# EAGLE design numeric (EAGLE 7.7.0)
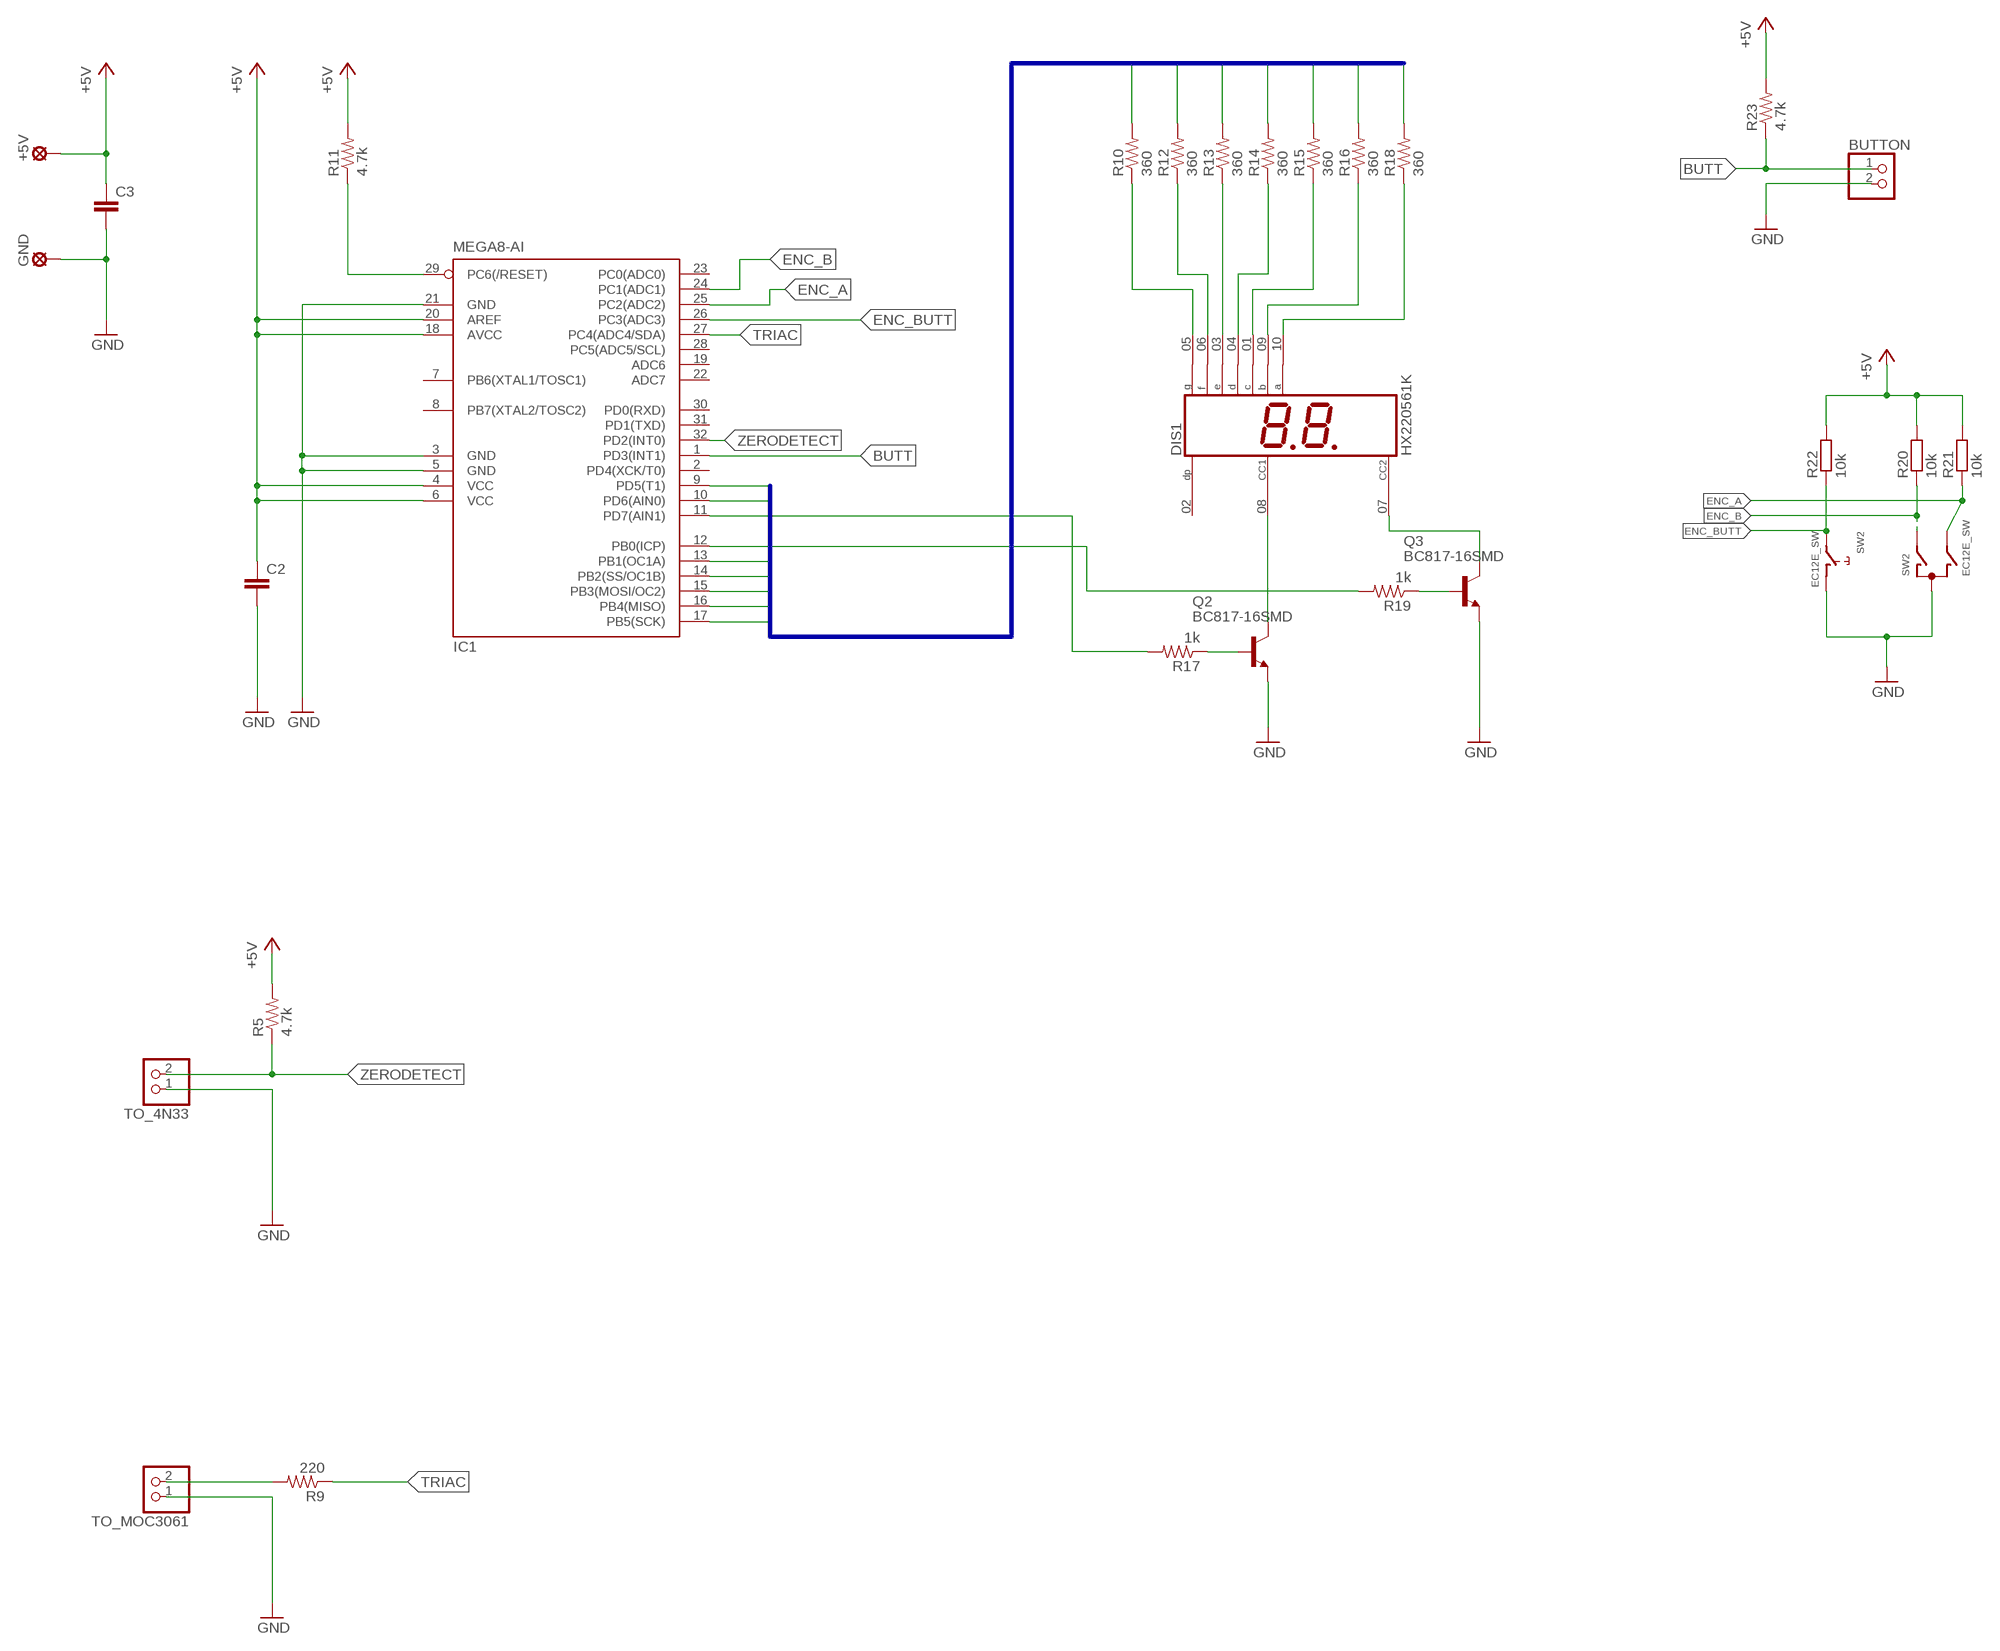
[diagram p0: schematic, sheet 1]

## Parts
+5V  LSP10  [LSP10]
BUTTON  PINHD-1X2  [1X02]
C2  C-EUC1206K  [C1206K]
C3  C-EUC1206K  [C1206K]
DIS1  HX220561K  [HX220561K]
GND  LSP10  [LSP10]
IC1  MEGA8-AI  [TQFP32-08]
Q2  BC817-16SMD  [SOT23-BEC]
Q3  BC817-16SMD  [SOT23-BEC]
R5  4.7k  R-US_M1206  [M1206]
R9  220  R-US_M1206  [M1206]
R10  360  R-US_M1206  [M1206]
R11  4.7k  R-US_M1206  [M1206]
R12  360  R-US_M1206  [M1206]
R13  360  R-US_M1206  [M1206]
R14  360  R-US_M1206  [M1206]
R15  360  R-US_M1206  [M1206]
R16  360  R-US_M1206  [M1206]
R17  1k  R-US_M1206  [M1206]
R18  360  R-US_M1206  [M1206]
R19  1k  R-US_M1206  [M1206]
R20  10k  R-EU_R1206  [R1206]
R21  10k  R-EU_R1206  [R1206]
R22  10k  R-EU_R1206  [R1206]
R23  4.7k  R-US_M1206  [M1206]
SW2  EC12E_SW  [ALPS_EC12E_SW]
TO_4N33  PINHD-1X2  [1X02]
TO_MOC3061  PINHD-1X2  [1X02]

## Nets
+5V: +5V.MP C2.1 C3.1 IC1.4(VCC) IC1.6(VCC) IC1.18(AVCC) IC1.20(AREF) R5.2 R11.2 R20.2 R21.2 R22.2 R23.2
B0: IC1.10(PD6(AIN0)) R16.2
B1: IC1.9(PD5(T1)) R18.2
B2: IC1.13(PB1(OC1A)) R15.2
B3: IC1.14(PB2(SS/OC1B)) R13.2
B4: IC1.15(PB3(MOSI/OC2)) R14.2
B5: IC1.16(PB4(MISO)) R10.2
B6: IC1.17(PB5(SCK)) R12.2
BASE_Q2: IC1.11(PD7(AIN1)) R17.2
BASE_Q3: IC1.12(PB0(ICP)) R19.2
BUTT: BUTTON.1 IC1.1(PD3(INT1)) R23.1
ENC_A: IC1.25(PC2(ADC2)) R21.1 SW2.B
ENC_B: IC1.24(PC1(ADC1)) R20.1 SW2.A
ENC_BUTT: IC1.26(PC3(ADC3)) R22.1 SW2.E(BUTT)
GND: BUTTON.2 C2.2 C3.2 GND.MP IC1.3(GND) IC1.5(GND) IC1.21(GND) Q2.E Q3.E SW2.C SW2.GND@1(BUTT_GND) TO_4N33.1 TO_MOC3061.1
N$14: DIS1.05(G) R10.1
N$15: DIS1.06(F) R12.1
N$16: DIS1.03(E) R13.1
N$17: DIS1.04(D) R14.1
N$18: DIS1.01(C) R15.1
N$19: DIS1.09(B) R16.1
N$20: DIS1.10(A) R18.1
N$21: DIS1.08(CC1) Q2.C
N$22: DIS1.07(CC2) Q3.C
N$23: Q3.B R19.1
N$24: Q2.B R17.1
N$30: R9.2 TO_MOC3061.2
RESET: IC1.29(PC6(/RESET)) R11.1
TRIAC: IC1.27(PC4(ADC4/SDA)) R9.1
ZERODETECT: IC1.32(PD2(INT0)) R5.1 TO_4N33.2
Unconnected: DIS1.02(DP) IC1.2(PD4(XCK/T0)) IC1.7(PB6(XTAL1/TOSC1)) IC1.8(PB7(XTAL2/TOSC2)) IC1.19(ADC6) IC1.22(ADC7) IC1.23(PC0(ADC0)) IC1.28(PC5(ADC5/SCL)) IC1.30(PD0(RXD)) IC1.31(PD1(TXD)) SW2.GND@2(GND) SW2.GND@3(GND)

## Buses
B[0..6]

## Library data of the parts
+5V GND = solpad:LSP10: SOLDER PAD drill 1.0 mm, distributor Buerklin, 12H555
BUTTON TO_4N33 TO_MOC3061 = pinhead:PINHD-1X2: PIN HEADER
C2 C3 = rcl:C-EU: CAPACITOR, European symbol
DIS1 = hx22053k:HX220561K: LED DISPLAY 2 x 1 character 7 segment, decimal points right
IC1 = atmel:MEGA8: MICROCONTROLLER 8 Kbytes FLASH, 1 kbytes SRAM, 512 bytes EEPROM, USART, 6-channel 10 bit ADC, 2-channel 8 bit ADC Pin compatible with Atmega48, ATMega88, ATMega168 Source: avr.lbr; MPN: ATMEGA8-16AU; OC_FARNELL: 9171371; OC_NEWARK: 73M8863
Q2 Q3 = transistor-npn:BC817*: NPN Transistor
R5 R9-R19 R23 = rcl:R-US_: RESISTOR, American symbol
R20-R22 = rcl:R-EU_: RESISTOR, European symbol
SW2 = switch-alps:EC12E_SW: ALPS rotary Encoder EC12E series with switch; MPN: EC12E2424407; OC_FARNELL: 1520813; OC_NEWARK: 74M1068

## Board
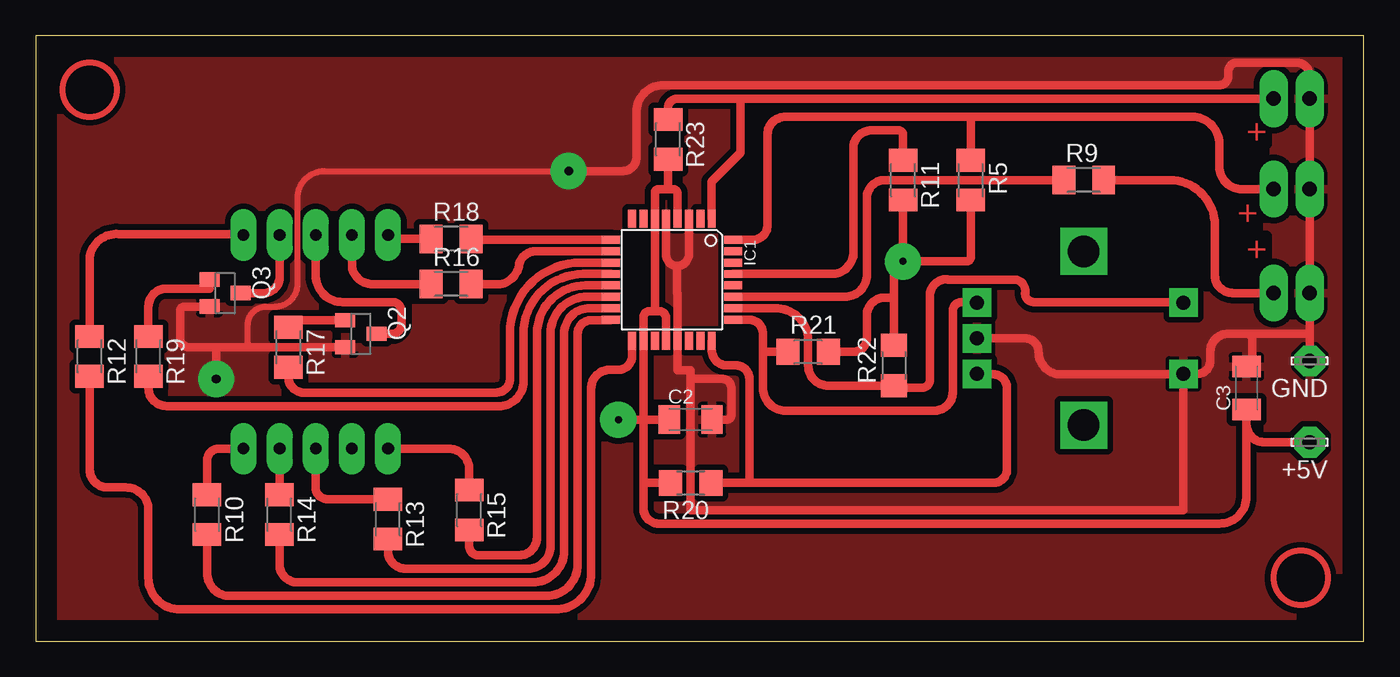
[diagram p1: board, top side]
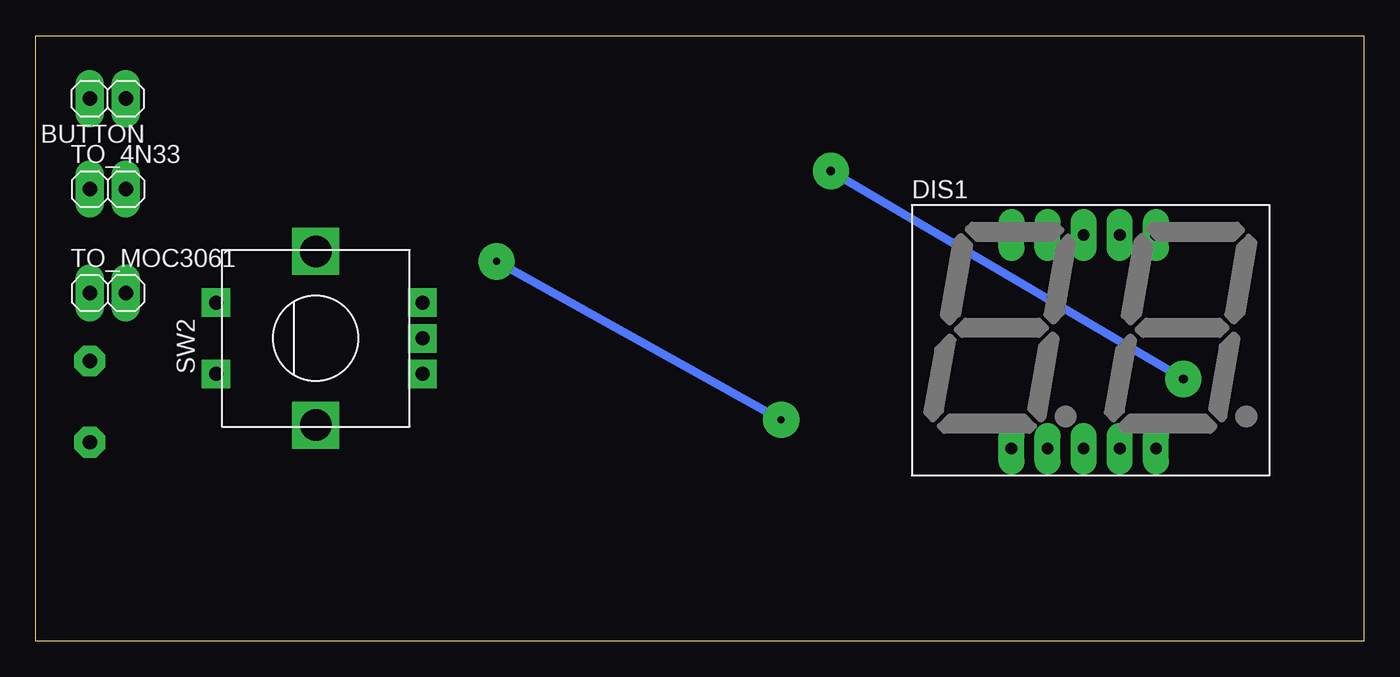
[diagram p2: board, bottom side, seen from below]

Size 93.33 x 42.53 mm. Coordinates in mm from the lower left corner, seen from the top.
Outline: 93.33,0 93.33,42.53 0,42.53 0,0 93.33,0
Copper layers (1*16): Top 0.035mm / dielectric 1.5mm / Bottom 0.035mm
Design rules "my_default": minimum track width 0.3mm, minimum drill 0.3mm, track to track 0.15mm, track to pad 0.15mm, pad to pad 0.2mm, via to via 2mm, smd to smd 0.1mm, copper to edge 1.5mm, drill to drill 1.5mm, minimum pad ring 0.5mm, minimum via ring 0.5mm, stop-mask expansion 4mil, vias tented up to drill 0mil, thermal gap 10mil

### Footprints (pad centres in the part's own frame; a part is rotated, then mirrored left to right if it is on the bottom)
LSP10 = drill 1.016 pad 2.159 octagon: MP 0,0
1X02 = drill 1.016 long: 1 -1.27,0; 2 1.27,0
C1206K = smd 1.5 x 2: 1 -1.5,0; 2 1.5,0
HX220561K = drill 0.813 long: 01 -12.08,-7.12; 02 -9.54,-7.12; 03 -7,-7.12; 04 -4.46,-7.12; 05 -1.92,-7.12; 06 -1.92,7.88; 07 -4.46,7.88; 08 -7,7.88; 09 -9.54,7.88; 10 -12.08,7.88
TQFP32-08 = smd 1.27 x 0.559: 1 -4.293,2.8; 2 -4.293,2; 3 -4.293,1.2; 4 -4.293,0.4; 5 -4.293,-0.4; 6 -4.293,-1.2; 7 -4.293,-2; 8 -4.293,-2.8; 17 4.293,-2.8; 18 4.293,-2; 19 4.293,-1.2; 20 4.293,-0.4; 21 4.293,0.4; 22 4.293,1.2; 23 4.293,2; 24 4.293,2.8 | smd 0.559 x 1.27: 9 -2.8,-4.293; 10 -2,-4.293; 11 -1.2,-4.293; 12 -0.4,-4.293; 13 0.4,-4.293; 14 1.2,-4.293; 15 2,-4.293; 16 2.8,-4.293; 25 2.8,4.293; 26 2,4.293; 27 1.2,4.293; 28 0.4,4.293; 29 -0.4,4.293; 30 -1.2,4.293; 31 -2,4.293; 32 -2.8,4.293
SOT23-BEC = smd 1 x 1.4: B -0.95,-1.1; C 0,1.1; E 0.95,-1.1
M1206 = smd 1.6 x 2: 1 -1.4,0; 2 1.4,0
R1206 = smd 1.6 x 1.803: 1 -1.422,0; 2 1.422,0
ALPS_EC12E_SW = drill 1 square: A -2.5,-7.5; B 2.5,-7.5; C 0,-7.5; E 2.5,7; GND@1 -2.5,7 | drill 2.2 square: GND@2 -6.1,0; GND@3 6.1,0

### Placement (x,y rotation side)
+5V  89.52,13.97 180 top
BUTTON  88.25,38.1 180 bottom
C2  46.03,15.56 0 top
C3  85.08,17.78 90 top
DIS1  12.69,20.64 0 bottom
GND  89.52,19.68 180 top
IC1  44.71,25.39 270 top
Q2  22.85,21.59 270 top
Q3  13.33,24.45 270 top
R5  65.71,32.38 270 top
R9  73.65,32.38 0 top
R10  12.05,8.89 270 top
R11  60.95,32.38 270 top
R12  3.8,20 270 top
R13  24.75,8.57 270 top
R14  17.13,8.89 270 top
R15  30.47,9.21 270 top
R16  29.2,25.08 0 top
R17  17.77,20.64 270 top
R18  29.2,28.26 0 top
R19  7.93,20 270 top
R20  46.03,11.11 180 top
R21  54.28,20.32 0 top
R22  60.32,19.37 90 top
R23  44.44,35.24 270 top
SW2  73.65,21.27 90 bottom
TO_4N33  88.25,31.75 0 bottom
TO_MOC3061  88.25,24.45 0 bottom

### Tracks (layer width: path | path; a pad name or v marks a point on that pad's centre or on a via)
+5V  (via drill 0.5 pad 2.54)
  Top 0.61: IC1.20 44.31,22.67 arc90 43.8,23.18 | 43.8,23.18 43.17,23.18 arc90 42.71,22.72 IC1.18 42.71,15.56 | 43.8,23.18 arc-90 43.51,23.47 IC1.6 43.51,31.45 arc-90 43.8,31.75 44.44,31.75 | 42.71,15.56 42.71,10.79 | 42.71,10.79 42.71,9.35 arc90 43.8,8.26 83.17,8.26 arc90 85.08,10.16 85.08,15.24 | v40.95,15.56 42.71,15.56 | C2.1 42.71,15.56 | +5V.MP 86.35,13.97 arc-90 85.08,15.24 | 85.08,15.24 C3.1 | IC1.4 45.11,31.4 arc90 44.76,31.75 44.44,31.75 | R20.2 43.03,11.11 arc90 42.71,10.79 | R11.2 v60.95,26.67 | R5.2 65.71,26.99 arc-90 65.39,26.67 v60.95,26.67 | R22.2 60.32,24.13 | 60.32,24.13 60.32,26.04 arc-90 v60.95,26.67 | R23.2 44.44,31.75 | R21.2 57.46,20.32 arc90 58.41,21.27 58.41,22.86 arc-90 59.68,24.13 60.32,24.13
  Bottom 0.61: v60.95,26.67 v40.95,15.56
B0
  Top 0.61: IC1.10 35.32,27.39 arc90 33.96,26.35 arc-90 32.06,25.08 R16.2
B1
  Top 0.61: IC1.9 30.67,28.19 arc-90 R18.2
B2
  Top 0.61: R15.2 30.47,6.67 arc90 31.1,6.03 33.96,6.03 arc90 35.23,7.3 35.23,21.59 arc-90 38.63,24.99 IC1.13
B3
  Top 0.61: R13.2 24.75,6.35 arc90 26.02,5.08 34.6,5.08 arc90 36.19,6.67 36.19,21.59 arc-90 38.78,24.19 IC1.14
B4
  Top 0.61: R14.2 17.13,5.4 arc90 18.4,4.13 34.91,4.13 arc90 37.14,6.35 37.14,21.59 arc-90 38.94,23.39 IC1.15
B5
  Top 0.61: R10.2 12.05,4.76 arc90 13.64,3.17 35.87,3.17 arc90 38.09,5.4 38.09,21.59 arc-90 39.04,22.54 40.37,22.54 arc90 IC1.16
B6
  Top 0.61: IC1.17 41.91,20.01 arc-90 40.95,19.05 40.31,19.05 arc90 39.04,17.78 39.04,4.76 arc-90 36.5,2.22 10.15,2.22 arc-90 7.93,4.45 7.93,9.21 arc90 6.34,10.79 5.07,10.79 arc-90 3.8,12.06 R12.2
BASE_Q2
  Top 0.61: R17.2 17.77,18.41 arc90 19.04,17.46 32.38,17.46 arc90 33.33,18.41 33.33,21.59 arc-90 38.33,26.59 IC1.11
BASE_Q3
  Top 0.61: R19.2 7.93,17.78 arc90 9.2,16.51 32.69,16.51 arc90 34.28,18.41 34.28,21.59 arc-90 38.48,25.79 IC1.12
BUTT
  Top 0.61: BUTTON.1 49.52,38.1 | IC1.1 47.51,32.28 49.52,34.29 49.52,38.1 | 49.52,38.1 45.08,38.1 arc90 44.44,37.47 R23.1
ENC_A
  Top 0.61: IC1.25 50.11,22.59 arc-90 51.11,21.59 51.11,20.32 | 51.11,20.32 51.11,17.78 arc90 52.7,16.19 63.17,16.19 arc90 64.44,17.46 64.44,23.18 arc-90 65.08,23.81 66.11,23.81 arc-90 SW2.B | R21.1 51.11,20.32
ENC_B
  Top 0.61: R20.1 49.84,11.11 | 49.84,11.11 67.3,11.11 arc90 68.25,12.06 68.25,17.78 arc90 67.3,18.73 66.19,18.73 arc-90 SW2.A | 49.84,11.11 arc90 50.16,11.43 50.16,18.41 arc90 49.2,19.37 48.57,19.37 arc-90 47.51,20.43 IC1.24
ENC_BUTT
  Top 0.61: IC1.26 52.17,23.39 arc-90 54.28,20.95 54.28,19.37 arc90 55.71,17.95 R22.1 arc90 60.48,17.78 62.22,17.78 arc90 62.86,18.41 62.86,24.45 arc-90 64.12,25.4 68.89,25.4 arc-90 69.52,24.45 arc90 70.16,23.81 80.61,23.81 arc-90 SW2.E
GND  (via drill 0.6 pad 2.54)
  Top 0.406: 14.91,20.95 14.91,22.23 arc-90 16.18,23.5 16.82,23.5 arc90 18.4,25.08 18.4,31.11 arc-90 20.31,33.02 v37.46,33.02
  Top 0.61: IC1.5 44.31,27.12 arc90 45.08,26.35 | 45.08,26.35 arc90 45.91,27.19 IC1.3 45.91,29.73 | Q3.E 10.47,23.5 arc90 10.15,23.18 10.15,21.27 arc90 10.79,20.64 12.69,20.64 | 12.69,20.64 15.23,20.64 arc-90 15.23,20.64 Q2.E arc90 Q2.E | C3.2 arc-90 85.48,19.68 85.48,21.18 arc90 85.08,21.59 | GND.MP 89.52,21.59 | 89.52,21.59 TO_MOC3061.1 TO_4N33.1 BUTTON.2 89.52,39.69 arc90 88.57,40.64 84.44,40.64 arc90 83.81,40.01 83.81,39.69 arc-90 83.17,39.05 44.12,39.05 arc90 42.22,37.15 42.22,33.97 arc-90 41.27,33.02 v37.46,33.02 | 45.08,26.35 45.08,24.45 arc-90 45.11,24.41 IC1.21 45.11,19.02 46.03,19.02 46.03,18.41 | SW2.C 69.52,21.27 arc-90 70.47,20.32 arc90 72.06,18.73 80.61,18.73 arc90 SW2.GND@1 | SW2.GND@1 81.63,18.77 arc90 82.54,19.68 82.54,20.32 arc-90 83.81,21.59 85.08,21.59 | 85.08,21.59 89.52,21.59 | 46.03,18.41 46.03,9.21 80.65,9.21 SW2.GND@1 | C2.2 48.57,15.56 arc90 48.89,15.88 48.89,17.78 arc90 48.25,18.41 46.03,18.41 | v12.69,18.41 12.69,20.64
  Bottom 0.61: v37.46,33.02 v12.69,18.41
  pour Top (isolate 0.406): -0.01,42.55 93.33,42.55 93.33,0 -0.01,0
N$14
  Top 0.61: DIS1.05 12.87,13.52 arc90 12.05,12.7 R10.1
N$15
  Top 0.61: R12.1 3.8,26.99 arc-90 6.02,28.57 14.55,28.57 arc-90 DIS1.06
N$16
  Top 0.61: R13.1 20.5,9.97 arc-90 19.67,10.79 19.67,13.5 arc-90 DIS1.03
N$17
  Top 0.61: DIS1.04 17.15,10.3 arc-90 R14.1
N$18
  Top 0.61: DIS1.01 29.02,13.52 arc-90 30.47,12.06 R15.1
N$19
  Top 0.61: DIS1.09 22.23,26.34 arc90 23.8,25.08 R16.1
N$20
  Top 0.61: R18.1 25.03,28.26 arc-90 DIS1.10
N$21
  Top 0.61: 24.44,21.59 Q2.C 25.07,21.59 arc90 25.71,22.23 25.71,23.18 arc90 25.07,23.81 21.58,23.81 arc-90 19.67,25.72 19.67,28.5 arc-90 DIS1.08
N$22
  Top 0.61: Q3.C 15.87,24.45 arc90 17.13,25.4 17.13,28.5 arc-90 DIS1.07
N$23
  Top 0.61: R19.1 7.93,23.5 arc-90 9.2,24.77 12.22,24.77 arc-90 Q3.B
N$24
  Top 0.61: Q2.B 18.27,22.54 arc90 R17.1
N$30
  Top 0.61: TO_MOC3061.2 84.13,24.45 arc-90 82.86,25.72 82.86,29.21 arc90 79.68,32.38 R9.2
RESET
  Top 0.61: R11.1 60.95,35.56 arc90 60.63,35.88 58.73,35.88 arc90 57.46,34.61 57.46,27.3 | 57.46,27.3 57.46,26.99 | IC1.29 55.94,25.79 arc90 57.46,27.3
TRIAC
  Top 0.61: R9.1 59.68,32.38 arc90 58.41,31.11 58.41,25.72 arc-90 56.88,24.19 IC1.27
ZERODETECT
  Top 0.61: IC1.32 50.4,28.19 arc90 51.43,29.21 51.43,35.56 arc-90 52.7,36.83 66.03,36.83 | 66.03,36.83 81.27,36.83 arc-90 83.17,34.92 83.17,33.34 arc90 84.76,31.75 TO_4N33.2 | R5.1 65.71,36.51 arc-90 66.03,36.83
(copper drawn outside any net)
  shapes: Top circle x2

### Text on the board
Top: + | + | +